# Altium schematic sheet Sheet3.SchDoc
size A4
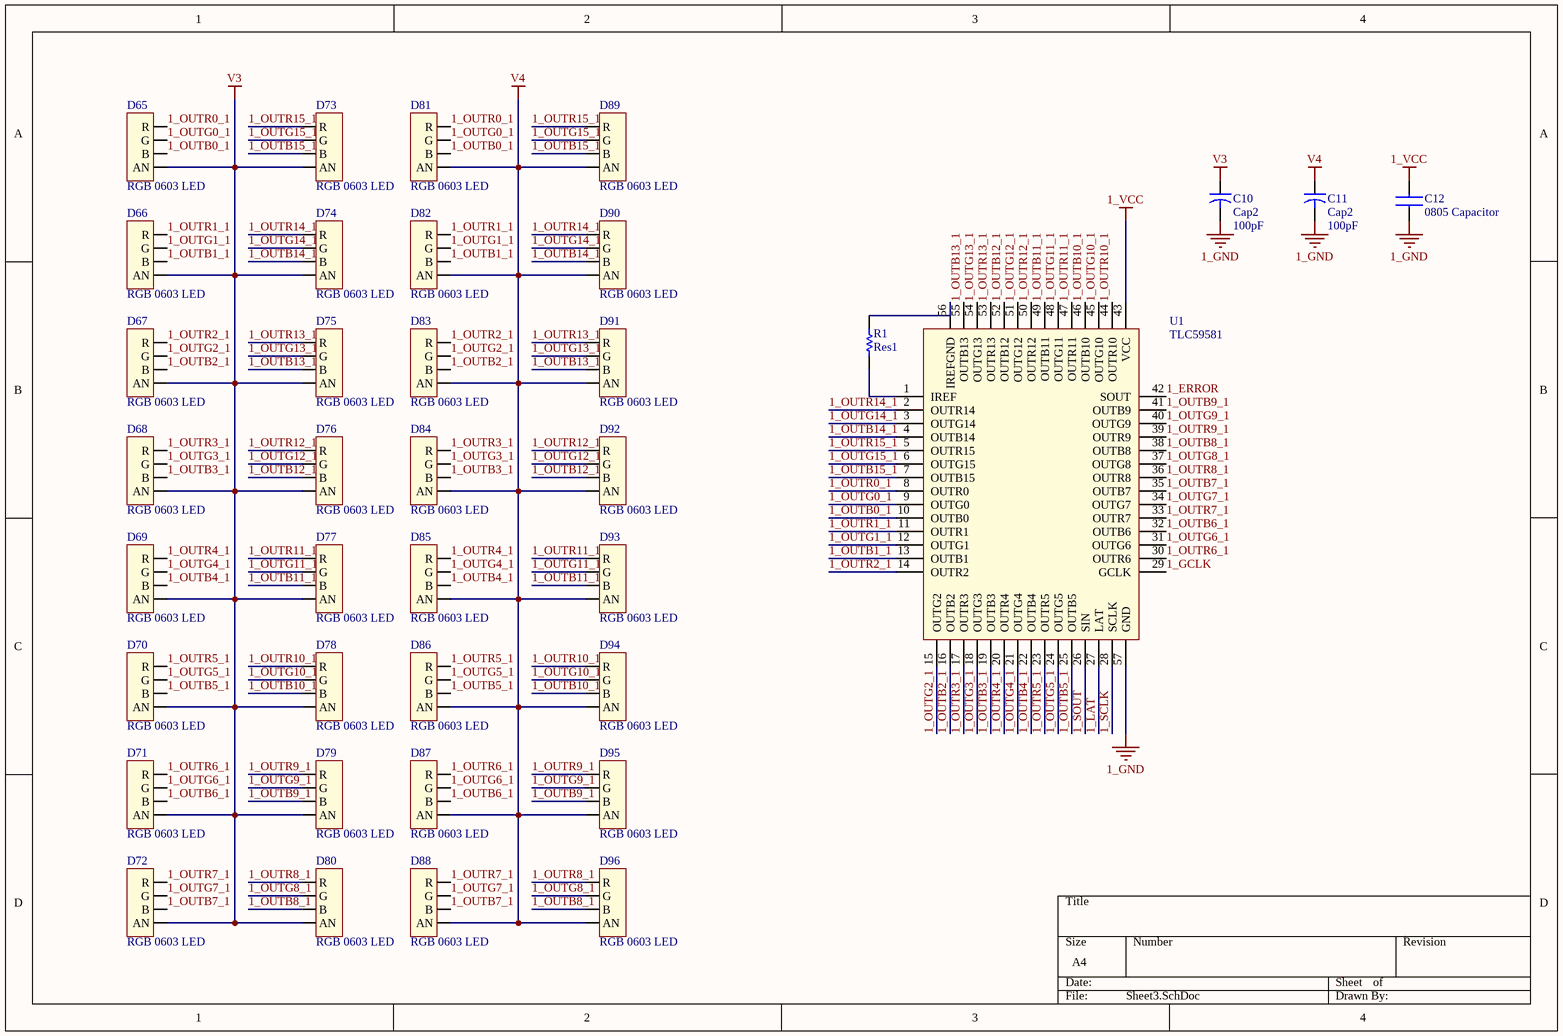
[diagram p0: Sheet3.SchDoc]

## Parts
C10  Cap2  value 100pF  [CAPR5-4X5]
C11  Cap2  value 100pF  [CAPR5-4X5]
C12  0805 Capacitor  [0805 Capacitor]
D65  RGB 0603 LED  [RGB LED]
D66  RGB 0603 LED  [RGB LED]
D67  RGB 0603 LED  [RGB LED]
D68  RGB 0603 LED  [RGB LED]
D69  RGB 0603 LED  [RGB LED]
D70  RGB 0603 LED  [RGB LED]
D71  RGB 0603 LED  [RGB LED]
D72  RGB 0603 LED  [RGB LED]
D73  RGB 0603 LED  [RGB LED]
D74  RGB 0603 LED  [RGB LED]
D75  RGB 0603 LED  [RGB LED]
D76  RGB 0603 LED  [RGB LED]
D77  RGB 0603 LED  [RGB LED]
D78  RGB 0603 LED  [RGB LED]
D79  RGB 0603 LED  [RGB LED]
D80  RGB 0603 LED  [RGB LED]
D81  RGB 0603 LED  [RGB LED]
D82  RGB 0603 LED  [RGB LED]
D83  RGB 0603 LED  [RGB LED]
D84  RGB 0603 LED  [RGB LED]
D85  RGB 0603 LED  [RGB LED]
D86  RGB 0603 LED  [RGB LED]
D87  RGB 0603 LED  [RGB LED]
D88  RGB 0603 LED  [RGB LED]
D89  RGB 0603 LED  [RGB LED]
D90  RGB 0603 LED  [RGB LED]
D91  RGB 0603 LED  [RGB LED]
D92  RGB 0603 LED  [RGB LED]
D93  RGB 0603 LED  [RGB LED]
D94  RGB 0603 LED  [RGB LED]
D95  RGB 0603 LED  [RGB LED]
D96  RGB 0603 LED  [RGB LED]
R1  Res1  [AXIAL-0.3]
U1  TLC59581  [TLC59581]

## Nets
1_GND: C10.2 C11.2 C12.1 U1.57(GND)
1_VCC: C12.2 U1.43(VCC)
V3: C10.1 D65.4(AN) D66.4(AN) D67.4(AN) D68.4(AN) D69.4(AN) D70.4(AN) D71.4(AN) D72.4(AN) D73.4(AN) D74.4(AN) D75.4(AN) D76.4(AN) D77.4(AN) D78.4(AN) D79.4(AN) D80.4(AN)
V4: C11.1 D81.4(AN) D82.4(AN) D83.4(AN) D84.4(AN) D85.4(AN) D86.4(AN) D87.4(AN) D88.4(AN) D89.4(AN) D90.4(AN) D91.4(AN) D92.4(AN) D93.4(AN) D94.4(AN) D95.4(AN) D96.4(AN)
1_ERROR: U1.42(SOUT)
1_GCLK: U1.29(GCLK)
1_LAT: U1.27(LAT)
1_OUTB0_1: D65.3(B) D81.3(B) U1.10(OUTB0)
1_OUTB1_1: D66.3(B) D82.3(B) U1.13(OUTB1)
1_OUTB2_1: D67.3(B) D83.3(B) U1.16(OUTB2)
1_OUTB3_1: D68.3(B) D84.3(B) U1.19(OUTB3)
1_OUTB4_1: D69.3(B) D85.3(B) U1.22(OUTB4)
1_OUTB5_1: D70.3(B) D86.3(B) U1.25(OUTB5)
1_OUTB6_1: D71.3(B) D87.3(B) U1.32(OUTB6)
1_OUTB7_1: D72.3(B) D88.3(B) U1.35(OUTB7)
1_OUTB8_1: D80.3(B) D96.3(B) U1.38(OUTB8)
1_OUTB9_1: D79.3(B) D95.3(B) U1.41(OUTB9)
1_OUTB10_1: D78.3(B) D94.3(B) U1.46(OUTB10)
1_OUTB11_1: D77.3(B) D93.3(B) U1.49(OUTB11)
1_OUTB12_1: D76.3(B) D92.3(B) U1.52(OUTB12)
1_OUTB13_1: D75.3(B) D91.3(B) U1.55(OUTB13)
1_OUTB14_1: D74.3(B) D90.3(B) U1.4(OUTB14)
1_OUTB15_1: D73.3(B) D89.3(B) U1.7(OUTB15)
1_OUTG0_1: D65.2(G) D81.2(G) U1.9(OUTG0)
1_OUTG1_1: D66.2(G) D82.2(G) U1.12(OUTG1)
1_OUTG2_1: D67.2(G) D83.2(G) U1.15(OUTG2)
1_OUTG3_1: D68.2(G) D84.2(G) U1.18(OUTG3)
1_OUTG4_1: D69.2(G) D85.2(G) U1.21(OUTG4)
1_OUTG5_1: D70.2(G) D86.2(G) U1.24(OUTG5)
1_OUTG6_1: D71.2(G) D87.2(G) U1.31(OUTG6)
1_OUTG7_1: D72.2(G) D88.2(G) U1.34(OUTG7)
1_OUTG8_1: D80.2(G) D96.2(G) U1.37(OUTG8)
1_OUTG9_1: D79.2(G) D95.2(G) U1.40(OUTG9)
1_OUTG10_1: D78.2(G) D94.2(G) U1.45(OUTG10)
1_OUTG11_1: D77.2(G) D93.2(G) U1.48(OUTG11)
1_OUTG12_1: D76.2(G) D92.2(G) U1.51(OUTG12)
1_OUTG13_1: D75.2(G) D91.2(G) U1.54(OUTG13)
1_OUTG14_1: D74.2(G) D90.2(G) U1.3(OUTG14)
1_OUTG15_1: D73.2(G) D89.2(G) U1.6(OUTG15)
1_OUTR0_1: D65.1(R) D81.1(R) U1.8(OUTR0)
1_OUTR1_1: D66.1(R) D82.1(R) U1.11(OUTR1)
1_OUTR2_1: D67.1(R) D83.1(R) U1.14(OUTR2)
1_OUTR3_1: D68.1(R) D84.1(R) U1.17(OUTR3)
1_OUTR4_1: D69.1(R) D85.1(R) U1.20(OUTR4)
1_OUTR5_1: D70.1(R) D86.1(R) U1.23(OUTR5)
1_OUTR6_1: D71.1(R) D87.1(R) U1.30(OUTR6)
1_OUTR7_1: D72.1(R) D88.1(R) U1.33(OUTR7)
1_OUTR8_1: D80.1(R) D96.1(R) U1.36(OUTR8)
1_OUTR9_1: D79.1(R) D95.1(R) U1.39(OUTR9)
1_OUTR10_1: D78.1(R) D94.1(R) U1.44(OUTR10)
1_OUTR11_1: D77.1(R) D93.1(R) U1.47(OUTR11)
1_OUTR12_1: D76.1(R) D92.1(R) U1.50(OUTR12)
1_OUTR13_1: D75.1(R) D91.1(R) U1.53(OUTR13)
1_OUTR14_1: D74.1(R) D90.1(R) U1.2(OUTR14)
1_OUTR15_1: D73.1(R) D89.1(R) U1.5(OUTR15)
1_SCLK: U1.28(SCLK)
1_SOUT: U1.26(SIN)
NetR1_1: R1.1 U1.1(IREF)
NetR1_2: R1.2 U1.56(IREFGND)

## Library data of the parts
C10 C11 = Cap2: Capacitor; Published: 23-Sep-2002; PackageReference: CAPR5-4X5; Publisher: Altium Limited; PackageDescription: Capacitor; 2 Leads
R1 = Res1: Resistor; Published: 8-Jun-2000; LatestRevisionDate: 17-Jul-2002; LatestRevisionNote: Re-released for DXP Platform.; PackageReference: AXIAL-0.3; Publisher: Altium Limited; PackageDescription: Axial Device, Thru-Hole; 2 Leads; 0.3 in Pin Spacing